# Altium schematic sheet IS62LV1024.SchDoc
size A4; Organization: Altium Limited; Address1: L3, 12a Rodborough Rd; Address2: Frenchs Forest; Address3: NSW; Address4: Australia 2086
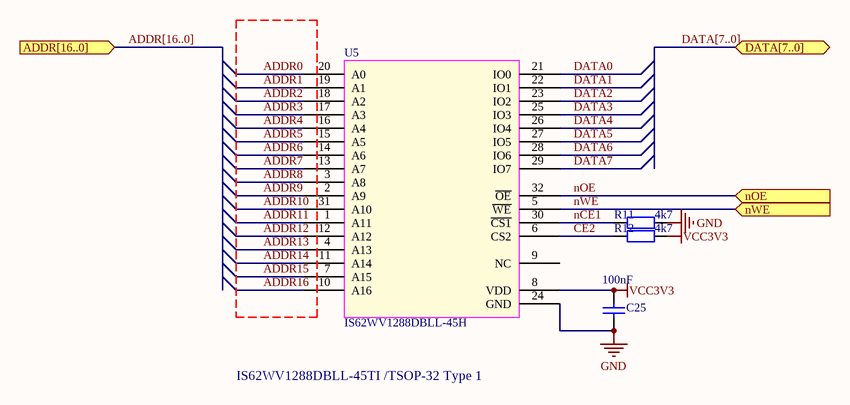
[diagram p0: IS62LV1024.SchDoc]

## Parts
C25  100nF  [R0603]
R11  4k7  [R0603]
R12  4k7  [R0603]
U5  IS62WV1288DBLL-45H  [sTSOP32]

## Ports
ADDR[16..0] (in), DATA[7..0] (bidir), nOE (in), nWE (in)

## Nets
GND: C25.1 R11.2 U5.24(GND)
VCC3V3: C25.2 R12.2 U5.8(VDD)
ADDR0: U5.20(A0)
ADDR1: U5.19(A1)
ADDR2: U5.18(A2)
ADDR3: U5.17(A3)
ADDR4: U5.16(A4)
ADDR5: U5.15(A5)
ADDR6: U5.14(A6)
ADDR7: U5.13(A7)
ADDR8: U5.3(A8)
ADDR9: U5.2(A9)
ADDR10: U5.31(A10)
ADDR11: U5.1(A11)
ADDR12: U5.12(A12)
ADDR13: U5.4(A13)
ADDR14: U5.11(A14)
ADDR15: U5.7(A15)
ADDR16: U5.10(A16)
CE2: R12.1 U5.6(CS2)
DATA0: U5.21(IO0)
DATA1: U5.22(IO1)
DATA2: U5.23(IO2)
DATA3: U5.25(IO3)
DATA4: U5.26(IO4)
DATA5: U5.27(IO5)
DATA6: U5.28(IO6)
DATA7: U5.29(IO7)
nCE1: R11.1 U5.30(~{CS1})
nOE: U5.32(~{OE}) ; port nOE
nWE: U5.5(~{WE}) ; port nWE

Not connected (* = marked no-connect by the designer): U5 9(NC)

## Buses and harness runs
bus ADDR[16..0] = port ADDR[16..0]
bus DATA[7..0] = port DATA[7..0]

## Notes on the sheet
- IS62WV1288DBLL-45TI /TSOP-32 Type 1
- Title
- Size:
- Date:
- A4
- Number:
- Time:
- Revision:
- Sheet
- of
- File:

## Library data of the parts
C25 = CAP_04: Value: 100nF
R11 R12 = RES_04: Value: 4k7
U5 = IS62WV1288DBLL-45TLI/TSOP-32: 128Kx8 LOW VOLTAGE,ULTRA LOW POWER SRAM